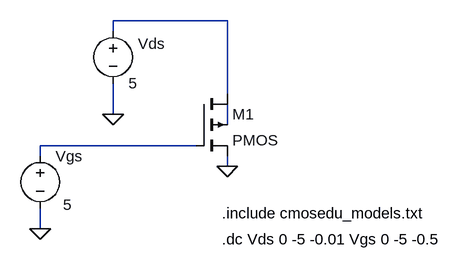
[diagram p0: schematic EXP_1 (pmos).asc]
EXP_1 (pmos).asc, the LTspice schematic file:
Version 4
SHEET 1 880 680
WIRE 192 64 16 64
WIRE 16 80 16 64
WIRE 192 176 192 64
WIRE 16 208 16 160
WIRE 192 224 192 192
WIRE 144 256 -96 256
WIRE -96 272 -96 256
WIRE 192 288 192 272
WIRE -96 384 -96 352
FLAG 192 288 0
FLAG 16 208 0
FLAG -96 384 0
SYMBOL voltage 16 64 R0
WINDOW 123 0 0 Left 0
WINDOW 39 0 0 Left 0
WINDOW 0 39 35 Left 2
SYMATTR InstName Vds
SYMATTR Value 5
SYMBOL voltage -96 256 R0
WINDOW 3 35 91 Left 2
WINDOW 123 0 0 Left 0
WINDOW 39 0 0 Left 0
SYMATTR Value 5
SYMATTR InstName Vgs
SYMBOL pmos4 144 176 R0
SYMATTR InstName M1
TEXT 184 360 Left 2 !.include cmosedu_models.txt
TEXT 184 400 Left 2 !.dc Vds 0 -5 -0.01 Vgs 0 -5 -0.5

The netlist it stands for:
* EXP_1 (pmos).asc
Vds N001 0 5
Vgs N003 0 5
M1 N001 N003 0 N002 PMOS
.model NMOS NMOS
.model PMOS PMOS
.lib standard.mos
.include cmosedu_models.txt
.dc Vds 0 -5 -0.01 Vgs 0 -5 -0.5
.backanno
.end